# EAGLE design fanmon (EAGLE 7.5.0)
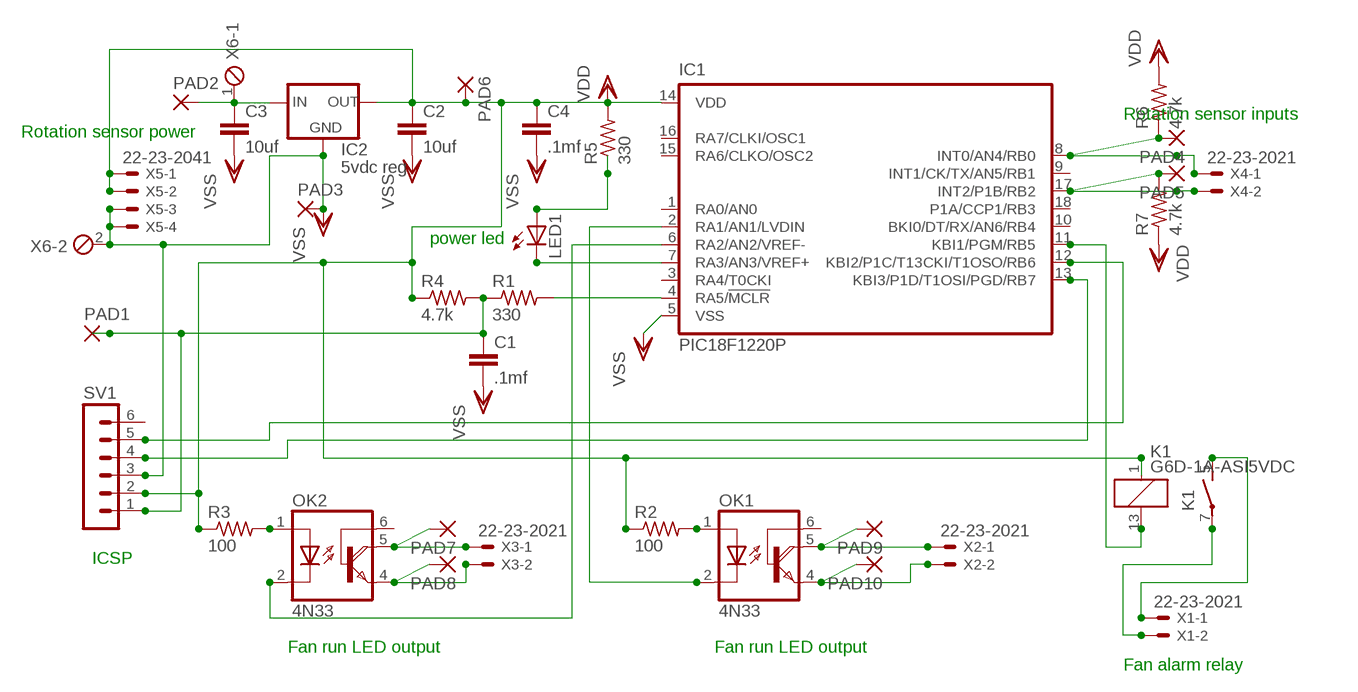
[diagram p0: schematic, sheet 1]

## Parts
C1  .1mf  C5/2.5  [C5B2.5]
C2  10uf  C5/2.5  [C5B2.5]
C3  10uf  C5/2.5  [C5B2.5]
C4  .1mf  C5/2.5  [C5B2.5]
IC1  PIC18F1220P  [DIL18]
IC2  5vdc reg  78XXL  [78XXL]
K1  G6D-1A-ASI5VDC  [G6D]
LED1  LED5MM  [LED5MM]
OK1  4N33  [DIL06]
OK2  4N33  [DIL06]
PAD1  1,6/0,8  [1,6/0,8]
PAD2  1,6/0,8  [1,6/0,8]
PAD3  1,6/0,8  [1,6/0,8]
PAD4  1,6/0,8  [1,6/0,8]
PAD5  1,6/0,8  [1,6/0,8]
PAD6  1,6/0,8  [1,6/0,8]
PAD7  1,6/0,8  [1,6/0,8]
PAD8  1,6/0,8  [1,6/0,8]
PAD9  1,6/0,8  [1,6/0,8]
PAD10  1,6/0,8  [1,6/0,8]
R1  330  R-US_0204/2V  [0204V]
R2  100  R-US_0204/2V  [0204V]
R3  100  R-US_0204/2V  [0204V]
R4  4.7k  R-US_0204/2V  [0204V]
R5  330  R-US_0204/2V  [0204V]
R6  4.7k  R-US_0204/2V  [0204V]
R7  4.7k  R-US_0204/2V  [0204V]
SV1  MA06-1  [MA06-1]
X1  22-23-2021  [22-23-2021]
X2  22-23-2021  [22-23-2021]
X3  22-23-2021  [22-23-2021]
X4  22-23-2021  [22-23-2021]
X5  22-23-2041  [22-23-2041]
X6  MPT2  [2POL254]

## Nets
N$1: IC1.4(RA5/!MCLR) R1.2
N$2: OK1.1(A) R2.2
N$3: OK2.1(A) R3.2
N$4: C1.1 PAD1.1(P) R1.1 R4.2 SV1.1
N$5: IC1.8(INT0/AN4/RB0) PAD4.1(P) R6.1 X4.1
N$6: C3.1 IC2.IN PAD2.1(P) X6.1
N$7: IC1.17(INT2/P1B/RB2) PAD5.1(P) R7.2 X4.2
N$8: IC1.2(RA1/AN1/LVDIN) OK1.2(C)
N$9: IC1.6(RA2/AN2/VREF-) OK2.2(C)
N$10: OK2.5(COL) PAD7.1(P) X3.1
N$11: OK2.4(E) PAD8.1(P) X3.2
N$12: OK1.5(COL) PAD9.1(P) X2.1
N$13: OK1.4(E) PAD10.1(P) X2.2
N$14: LED1.A R5.1
N$15: IC1.7(RA3/AN3/VREF+) LED1.K(C)
N$16: IC1.11(KBI1/PGM/RB5) K1.13
N$17: K1.7(2:P) X1.2
N$18: K1.5(2:S) X1.1
N$20: IC1.13(KBI3/P1D/T1OSI/PGD/RB7) SV1.4
N$21: IC1.12(KBI2/P1C/T13CKI/T1OSO/RB6) SV1.5
VDD: C2.1 C4.1 IC1.14(VDD) IC2.OUT K1.1 PAD6.1(P) R2.1 R3.1 R4.1 R5.2 R6.2 R7.1 SV1.2 X5.1 X5.2
VSS: C1.2 C2.2 C3.2 C4.2 IC1.5(VSS) IC2.GND PAD3.1(P) SV1.3 X5.3 X5.4 X6.2
Unconnected: IC1.1(RA0/AN0) IC1.3(RA4/T0CKI) IC1.9(INT1/CK/TX/AN5/RB1) IC1.10(BKI0/DT/RX/AN6/RB4) IC1.15(RA6/CLKO/OSC2) IC1.16(RA7/CLKI/OSC1) IC1.18(P1A/CCP1/RB3) OK1.6(B) OK2.6(B) SV1.6

## Notes on the sheet
- Rotation sensor inputs
- Rotation sensor power
- power led
- ICSP
- Fan run LED output | Fan run LED output
- Fan alarm relay

## Library data of the parts
C1-C4 = capacitor-wima:C: CAPACITOR naming: grid - package width
IC1 = microchip:PIC18F1*20: 18/20/28-Pin High-Performance, Enhanced Flash Microcontrollers with 10-bit A/D and nanoWatt Technology Source: ww1.microchip.com/downloads/en/DeviceDoc/39605c.pdf; MF: MICROCHIP; MPN: PIC18F1220-I/P; OC_FARNELL: 9761977; OC_NEWARK: 92C2429
IC2 = v-reg:78XXL: VOLTAGE REGULATOR
K1 = relay:G6D?*: OMRON Slim, Miniature PCB Relay 17.5 × 6.5 × 12.5 mm with Socked Source: http://ecb.omron.com.sg/pdf/relay/power/G6D.pdf; OC_FARNELL: 9812660; OC_NEWARK: unknown
LED1 = led:LED: LED OSRAM: - CHIPLED LG R971, LG N971, LY N971, LG Q971, LY Q971, LO R971, LY R971 LH N974, LH R974 LS Q976, LO Q976, LY Q976 LO Q996 - Hyper CHIPLED LW Q18S LB Q993, LB Q99A, LB R99A - SideLED LS A670, LO A670, LY A670, LG A670, LP A670 LB A673, LV A673, LT A673, LW A673 LH A674 LY A675 LS A676, LA A676, LO A676, LY A676, LW A676 LS A679, LY A679, LG A679 - Hyper Micro SIDELED® LS Y876, LA Y876, LO Y876, LY Y876 LT Y87S - SmartLED LW L88C, LW L88S LB L89C, LB L89S, LG L890 LS L89K, LO L89K, LY L89K LS L896, LA L896, LO L896, LY L896 - TOPLED LS T670, LO T670, LY T670, LG T670, LP T670 LSG T670, LSP T670, LSY T670, LOP T670, LYG T670 LG T671, LOG T671, LSG T671 LB T673, LV T673, LT T673, LW T673 LH T674 LS T676, LA T676, LO T676, LY T676, LB T676, LH T676, LSB T676, LW T676 LB T67C, LV T67C, LT T67C, LS T67K, LO T67K, LY T67K, LW E67C LS E67B, LA E67B, LO E67B, LY E67B, LB E67C, LV E67C, LT E67C LW T67C LS T679, LY T679, LG T679 LS T770, LO T770, LY T770, LG T770, LP T770 LB T773, LV T773, LT T773, LW T773 LH T774 LS E675, LA E675, LY E675, LS T675 LS T776, LA T776, LO T776, LY T776, LB T776 LHGB T686 LT T68C, LB T68C - Hyper Mini TOPLED® LB M676 - Mini TOPLED Santana® LG M470 LS M47K, LO M47K, LY M47K Source: http://www.osram.convergy.de LUXEON: - LUMILED® LXK2-PW12-R00, LXK2-PW12-S00, LXK2-PW14-U00, LXK2-PW14-V00 LXK2-PM12-R00, LXK2-PM12-S00, LXK2-PM14-U00 LXK2-PE12-Q00, LXK2-PE12-R00, LXK2-PE12-S00, LXK2-PE14-T00, LXK2-PE14-U00 LXK2-PB12-K00, LXK2-PB12-L00, LXK2-PB12-M00, LXK2-PB14-N00, LXK2-PB14-P00, LXK2-PB14-Q00 LXK2-PR12-L00, LXK2-PR12-M00, LXK2-PR14-Q00, LXK2-PR14-R00 LXK2-PD12-Q00, LXK2-PD12-R00, LXK2-PD12-S00 LXK2-PH12-R00, LXK2-PH12-S00 LXK2-PL12-P00, LXK2-PL12-Q00, LXK2-PL12-R00 Source: www.luxeon.com KINGBRIGHT: KA-3528ASYC Source: www.kingbright.com
OK1 OK2 = optocoupler:4N33: MOTOROLA OPTO COUPLER; MF: VISHAY/TELEFUNKEN; MPN: 4N33; OC_FARNELL: 1469601; OC_NEWARK: 88K1390
PAD1-PAD10 = wirepad:1,6/0,8: THROUGH-HOLE PAD
R1-R7 = resistor:R-US_: RESISTOR, American symbol
SV1 = con-lstb:MA06-1: PIN HEADER; OC_FARNELL: unknown; OC_NEWARK: unknown
X1-X4 = con-molex:22-23-2021: .100" (2.54mm) Center Header - 2 Pin; MF: MOLEX; MPN: 22-23-2021; OC_FARNELL: 1462926; OC_NEWARK: 25C3832
X5 = con-molex:22-23-2041: .100" (2.54mm) Center Header - 4 Pin; MF: MOLEX; MPN: 22-23-2041; OC_FARNELL: 1462920; OC_NEWARK: 38C0355
X6 = con-phoenix-254:MPT2: PHOENIX CONNECTOR; OC_FARNELL: unknown; OC_NEWARK: unknown

## Board
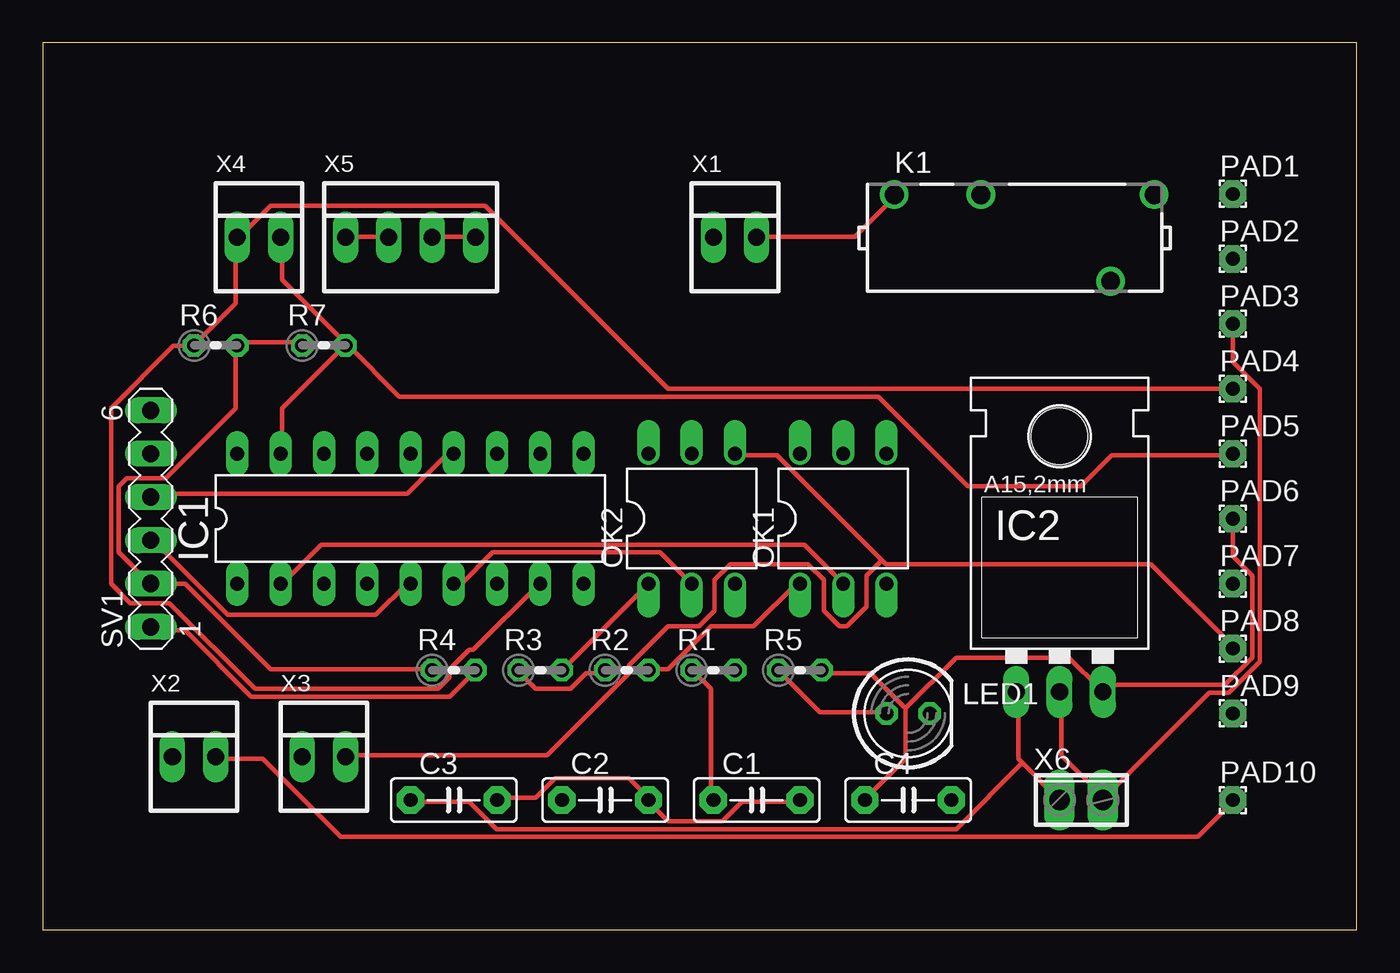
[diagram p1: board, top side]
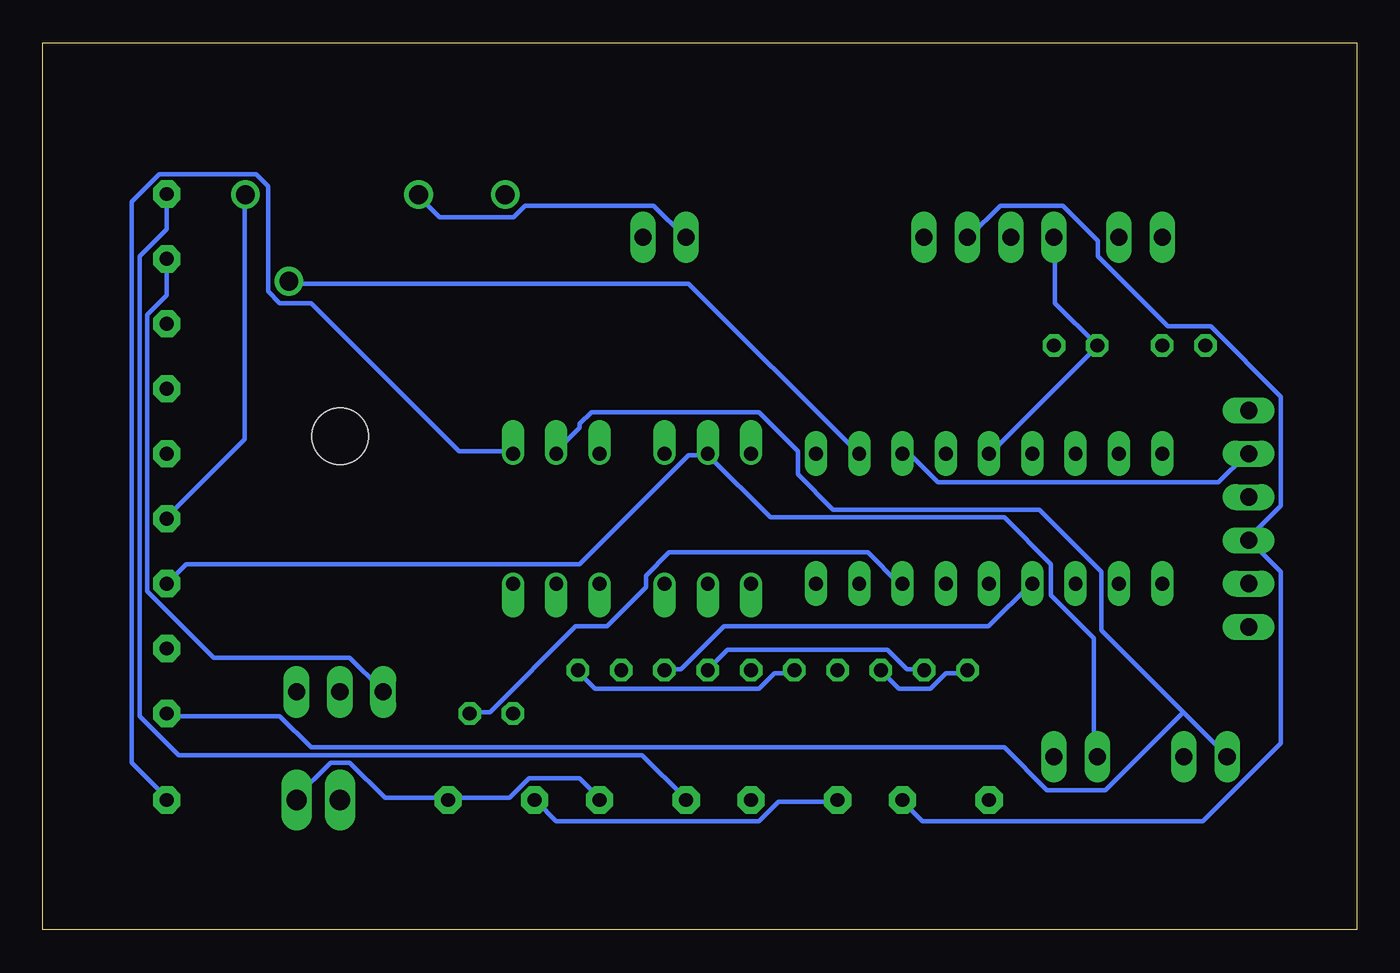
[diagram p2: board, bottom side, seen from below]

Size 77.14 x 52.06 mm. Coordinates in mm from the lower left corner, seen from the top.
Outline: 0,0 77.14,0 77.14,52.06 0,52.06 0,0
Copper layers (1*16): Top 0.035mm / dielectric 1.5mm / Bottom 0.035mm
Design rules "default": minimum track width 10mil, minimum drill 24mil, track to track 8mil, track to pad 8mil, pad to pad 8mil, via to via 8mil, smd to smd 8mil, copper to edge 40mil, drill to drill 8mil, minimum pad ring 10mil, minimum via ring 8mil, stop-mask expansion 4mil, vias tented up to drill 0mil, thermal gap 10mil

### Footprints (pad centres in the part's own frame; a part is rotated, then mirrored left to right if it is on the bottom)
C5B2.5 = drill 0.813 pad 1.6 octagon: 1 -2.54,0; 2 2.54,0
DIL18 = drill 0.813 long: 1 -10.16,-3.81; 2 -7.62,-3.81; 3 -5.08,-3.81; 4 -2.54,-3.81; 5 0,-3.81; 6 2.54,-3.81; 7 5.08,-3.81; 8 7.62,-3.81; 9 10.16,-3.81; 10 10.16,3.81; 11 7.62,3.81; 12 5.08,3.81; 13 2.54,3.81; 14 0,3.81; 15 -2.54,3.81; 16 -5.08,3.81; 17 -7.62,3.81; 18 -10.16,3.81
78XXL = drill 1.016 long: GND 0,-3.81; IN -2.54,-3.81; OUT 2.54,-3.81 | hole 3.302: 0,11.176
G6D = drill 1.1 pad 1.676: 1 8.08,2.5; 5 -2.08,2.5; 7 -7.16,2.5; 13 5.54,-2.58
LED5MM = drill 0.813 octagon: A -1.27,0; K 1.27,0
DIL06 = drill 0.813 offset: 1 -2.54,-3.81; 2 0,-3.81; 3 2.54,-3.81; 4 2.54,3.81; 5 0,3.81; 6 -2.54,3.81
1,6/0,8 = drill 0.813 pad 1.6 octagon: 1 0,0
0204V = drill 0.813 octagon: 1 -1.27,0; 2 1.27,0
MA06-1 = drill 1.016 long: 1 -6.35,0; 2 -3.81,0; 3 -1.27,0; 4 1.27,0; 5 3.81,0; 6 6.35,0
22-23-2021 = drill 1 long: 1 -1.27,0; 2 1.27,0
22-23-2041 = drill 1 long: 1 -3.81,0; 2 -1.27,0; 3 1.27,0; 4 3.81,0
2POL254 = drill 1.2 long: 1 -1.27,0; 2 1.27,0

### Placement (x,y rotation side)
C1  41.91,7.62 0 top
C2  33.02,7.62 0 top
C3  24.13,7.62 0 top
C4  50.8,7.62 0 top
DRILEGEND  [DRILEGEND]  0,-7.62 0 top  (outside the outline)
IC1  21.59,24.13 0 top
IC2  59.69,17.78 0 top
K1  57.15,40.64 0 top
LED1  50.8,12.7 0 top
OK1  46.99,24.13 0 top
OK2  38.1,24.13 0 top
PAD1  69.85,43.18 0 top
PAD2  69.85,39.37 0 top
PAD3  69.85,35.56 0 top
PAD4  69.85,31.75 0 top
PAD5  69.85,27.94 0 top
PAD6  69.85,24.13 0 top
PAD7  69.85,20.32 0 top
PAD8  69.85,16.51 0 top
PAD9  69.85,12.7 0 top
PAD10  69.85,7.62 0 top
R1  39.37,15.24 0 top
R2  34.29,15.24 0 top
R3  29.21,15.24 0 top
R4  24.13,15.24 0 top
R5  44.45,15.24 0 top
R6  10.16,34.29 0 top
R7  16.51,34.29 0 top
SV1  6.35,24.13 90 top
X1  40.64,40.64 0 top
X2  8.89,10.16 0 top
X3  16.51,10.16 0 top
X4  12.7,40.64 0 top
X5  21.59,40.64 0 top
X6  60.96,7.62 0 top

### Tracks (layer width: path | path; a pad name or v marks a point on that pad's centre or on a via)
N$1
  Bottom 0.254: R1.2 40.59,15.29 39.68,15.29 37.16,17.8 21.61,17.8 19.1,20.32 IC1.4
N$2
  Top 0.254: R2.2 35.56,15.29 36.7,15.29 39.22,17.8 41.73,17.8 44.25,20.32 OK1.1
N$3
  Top 0.254: OK2.1 R3.2
N$4
  Top 0.254: 39.45,7.75 C1.1 39.22,7.75 39.22,14.15 38.3,15.06 R1.1 | SV1.1 6.53,17.58 8.36,17.58 12.24,13.69 23.9,13.69 25.27,15.06 R4.2
  Bottom 0.254: R4.2 25.5,15.29 26.42,15.29 27.56,16.43 36.93,16.43 38.08,15.29 R1.1 | PAD1.1 69.85,41.12 71.45,39.52 71.45,12.55 69.16,10.26 41.96,10.26 39.45,7.75 C1.1
N$5
  Top 0.254: IC1.8 29.16,20.32 25.27,16.43 25.04,16.43 23.9,15.29 23.9,14.83 23.22,14.15 12.47,14.15 7.44,19.18 5.16,19.18 4.01,20.32 4.01,30.61 7.67,34.27 8.81,34.27 R6.1 9.04,34.49 11.33,36.78 11.33,40.44 X4.1 11.56,40.66 13.39,42.49 25.96,42.49 36.7,31.75 PAD4.1
N$6
  Top 0.254: X6.1 57.51,9.8 | 57.51,9.8 57.28,10.03 57.28,13.92 IC2.IN | 57.51,9.8 53.62,5.92 26.64,5.92 25.04,7.52 21.61,7.52 C3.1
  Bottom 0.254: PAD2.1 69.85,37.24 70.99,36.09 70.99,19.86 67.11,15.98 59.11,15.98 57.28,14.15 IC2.IN
N$7
  Top 0.254: IC1.17 14.07,28.09 14.07,30.61 17.73,34.27 R7.2 | X4.2 14.07,40.44 14.07,38.15 17.73,34.49 R7.2 | PAD5.1 69.85,27.86 62.76,27.86 60.94,26.04 54.3,26.04 49.05,31.29 20.93,31.29 17.96,34.27 R7.2
N$8
  Top 0.254: OK1.2 44.7,22.61 16.36,22.61 14.07,20.32 IC1.2
N$9
  Top 0.254: IC1.6 24.59,20.32 26.42,22.15 36.25,22.15 38.08,20.32 OK2.2
N$10
  Bottom 0.254: PAD7.1 68.71,21.46 45.62,21.46 39.22,27.86 38.3,27.86 OK2.5 38.08,27.86 34.42,24.21 20.7,24.21 17.96,21.46 17.96,19.63 15.44,17.12 15.44,10.26 X3.1
N$11
  Top 0.254: 49.28,21.69 49.51,21.46 65.05,21.46 69.85,16.66 PAD8.1 | 49.28,21.69 43.1,27.86 40.82,27.86 OK2.4 | 49.28,21.69 48.36,20.78 48.36,18.95 47.22,17.8 46.76,17.8 45.85,18.72 45.85,20.55 44.93,21.46 40.36,21.46 39.45,20.55 39.45,18.72 38.53,17.8 36.7,17.8 34.42,15.52 34.42,15.06 29.62,10.26 17.96,10.26 X3.2
N$12
  Bottom 0.254: 10.18,12.78 7.67,10.26 X2.1 | 10.18,12.78 14.99,17.58 14.99,21.01 18.64,24.66 30.76,24.66 32.82,26.72 32.82,28.09 35.1,30.38 44.93,30.38 45.62,29.69 45.62,29.46 46.99,28.09 OK1.5 | 10.18,12.78 14.76,8.2 18.19,8.2 20.7,10.72 61.39,10.72 63.22,12.55 69.85,12.55 PAD9.1
N$13
  Top 0.254: X2.2 10.18,10.03 12.93,10.03 17.5,5.46 67.79,5.46 69.85,7.52 PAD10.1
  Bottom 0.254: OK1.4 49.73,28.09 52.71,28.09 61.39,36.78 63.22,36.78 63.91,37.47 63.91,43.64 64.59,44.32 70.31,44.32 71.91,42.72 71.91,9.8 69.85,7.75 PAD10.1
N$14
  Top 0.254: LED1.A 49.51,12.78 45.62,12.78 43.33,15.06 R5.1
N$15
  Bottom 0.254: LED1.K 52.02,12.78 50.88,12.78 45.85,17.8 44.02,17.8 41.73,20.09 41.73,20.78 40.36,22.15 28.7,22.15 26.87,20.32 IC1.7
N$16
  Bottom 0.254: IC1.11 29.39,28.09 39.22,37.92 62.54,37.92 K1.13
N$17
  Top 0.254: X1.2 41.96,40.66 47.68,40.66 49.96,42.95 K1.7
N$18
  Bottom 0.254: X1.1 39.45,40.66 41.28,42.49 48.82,42.49 49.51,41.81 53.85,41.81 54.99,42.95 K1.5
N$20
  Top 0.254: IC1.13 24.13,27.86 23.67,27.86 21.39,25.58 6.53,25.58 SV1.4
N$21
  Bottom 0.254: IC1.12 26.64,27.86 26.19,27.86 24.59,26.26 8.13,26.26 6.53,27.86 SV1.5
VDD
  Top 0.254: X5.1 17.96,40.66 20.24,40.66 X5.2 | R7.1 15.21,34.49 11.56,34.49 R6.2 11.33,34.27 11.33,30.61 7.21,26.49 4.93,26.49 4.47,26.04 4.47,22.15 6.3,20.32 SV1.2 8.36,20.32 13.39,15.29 22.76,15.29 R4.1 | R2.1 32.82,15.06 31.9,15.06 30.99,14.15 28.93,14.15 28.02,15.06 R3.1 | 50.65,13.01 48.59,15.06 45.85,15.06 R5.2 | 50.65,13.01 50.65,10.03 48.36,7.75 C4.1 | 50.65,13.01 53.62,15.98 60.25,15.98 62.08,14.15 IC2.OUT 62.31,14.15 62.54,14.38 69.39,14.38 70.99,15.98 70.99,20.78 69.85,21.92 PAD6.1
  Bottom 0.254: IC1.14 21.39,28.09 15.21,34.27 R7.1 17.73,36.78 17.73,40.44 X5.1 | R4.1 22.99,15.06 24.13,15.06 25.04,14.15 26.87,14.15 27.79,15.06 R3.1 | C2.1 30.53,7.52 33.96,7.52 35.1,6.37 46.99,6.37 48.13,7.52 C4.1 | K1.1 65.28,42.95 65.28,28.78 69.85,24.21 PAD6.1 | R2.1 33.05,15.06 34.19,15.06 35.1,14.15 44.7,14.15 45.62,15.06 R5.2
VSS
  Top 0.254: X5.3 22.99,40.66 25.27,40.66 X5.4 | IC1.5 21.39,20.32 19.56,18.49 10.87,18.49 6.53,22.84 SV1.3 | C3.2 26.87,7.75 28.93,7.75 30.07,8.89 34.42,8.89 35.56,7.75 C2.2 35.56,7.52 36.7,6.37 39.9,6.37 41.05,7.52 44.25,7.52 C1.2 | 62.31,7.75 59.79,10.26 59.79,13.92 IC2.GND | PAD3.1 69.85,33.35 71.45,31.75 71.45,15.75 69.62,13.92 68.48,13.92 62.31,7.75 | 62.31,7.75 X6.2
  Bottom 0.254: X5.3 22.76,40.66 20.93,42.49 17.27,42.49 15.21,40.44 15.21,39.52 11.1,35.41 8.59,35.41 4.47,31.29 4.47,24.89 6.3,23.06 SV1.3 6.3,22.84 4.47,21.01 4.47,10.95 9.04,6.37 25.5,6.37 26.64,7.52 C3.2 | C1.2 44.48,7.75 45.62,8.89 48.59,8.89 49.73,7.75 53.16,7.75 C4.2 53.39,7.75 57.05,7.75 59.11,9.8 60.25,9.8 62.31,7.75 X6.2

### Text on the board
DrillLegend: LAYER-STACK
DrillLegend_01-16: 01-16
DrillLegend_01-20: 01-20